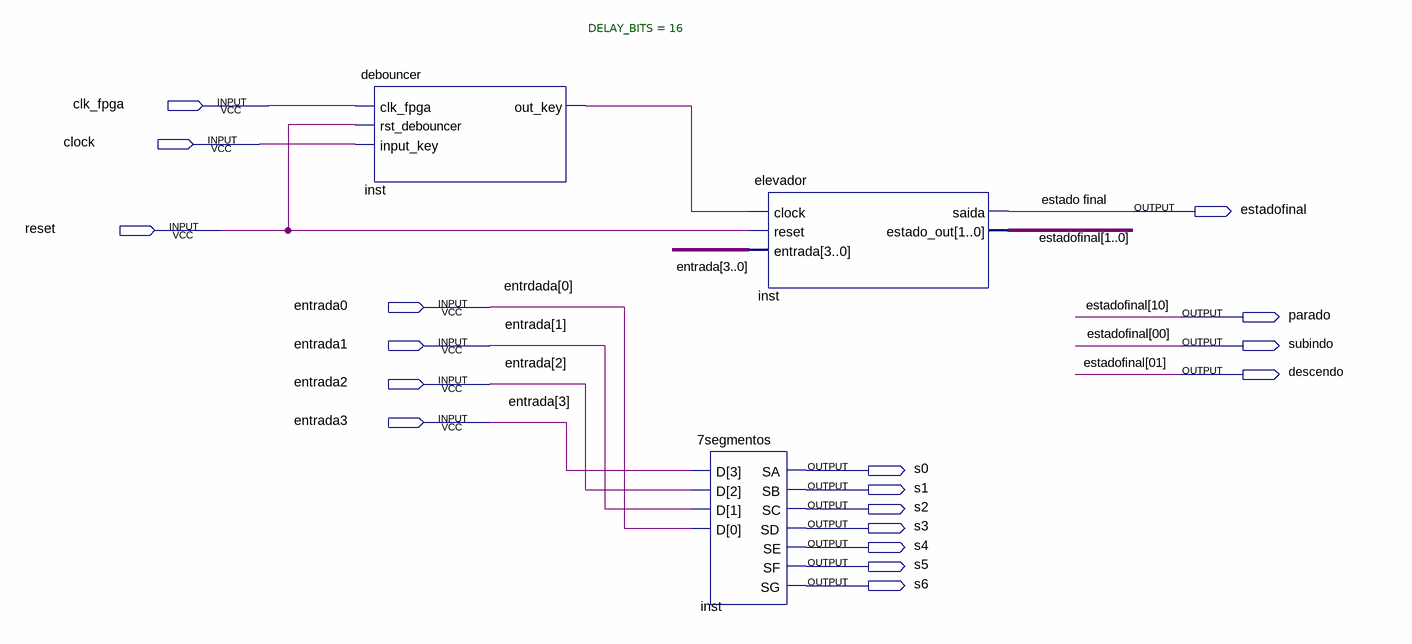
[diagram p0: schematic sheet]
// Quartus schematic elevador_block.bdf as structural Verilog: 3 symbols, 18 pins
module elevador_block (
  input  clk_fpga,
  input  clock,
  input  reset,
  input  entrada0,
  input  entrada1,
  input  entrada2,
  input  entrada3,
  output estadofinal,
  output parado,
  output subindo,
  output descendo,
  output s0,
  output s1,
  output s2,
  output s3,
  output s4,
  output s5,
  output s6
);

  wire inst_out_key;

  debouncer #(.DELAY_BITS(16)) inst (
    .clk_fpga(clk_fpga), .rst_debouncer(reset), .input_key(clock), .out_key(inst_out_key));
  elevador inst_dup2 (
    .clock(inst_out_key), .reset(reset), .entrada({entrada3, entrada2, entrada1, entrada0}),
    .saida(estadofinal), .estado_out({descendo, subindo}));
  \7segmentos  inst_dup3 (
    .D({entrada3, entrada2, entrada1, entrada0}), .SA(s0), .SB(s1), .SC(s2), .SD(s3), .SE(s4), .SF(s5),
    .SG(s6));

  // Other names for the same wires on the sheet: entrdada[0] = entrada0; estado final = estadofinal;
  //   estadofinal (some bits) = {parado, descendo, subindo}
endmodule
